# EAGLE design pandemic_proto_v0001 (EAGLE 9.0.0)

## Sheet 1 of 4: PSU
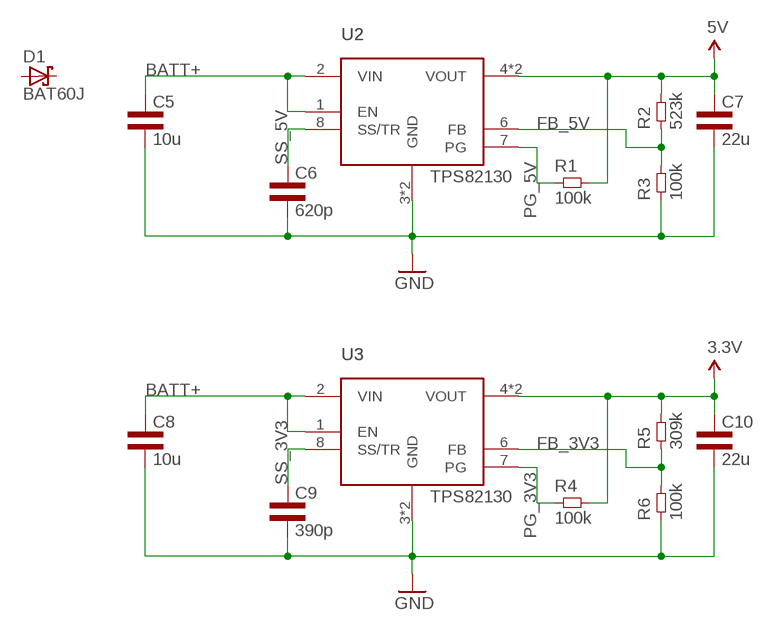
[diagram p0: schematic, sheet 1]

### Parts
C5  10u  CAP1206L3  [1206L3]
C6  620p  CAP0402L3  [0402L3]
C7  22u  CAP0805L3  [0805L3]
C8  10u  CAP1206L3  [1206L3]
C9  390p  CAP0402L3  [0402L3]
C10  22u  CAP0805L3  [0805L3]
D1  BAT60J  [SOD323_ST]
R1  100k  RES0402L3  [0402L3]
R2  523k  RES0402L3  [0402L3]
R3  100k  RES0805L3  [0805L3]
R4  100k  RES0402L3  [0402L3]
R5  309k  RES0402L3  [0402L3]
R6  100k  RES0805L3  [0805L3]
U2  TPS82130  [SIL0008C]
U3  TPS82130  [SIL0008C]

### Nets
3.3V: C10.1 R4.P$2 R5.P$2 U3.4(VOUT) U3.5(VOUT) ; also sheet 3
5V: C7.1 R1.P$2 R2.P$2 U2.4(VOUT) U2.5(VOUT)
BATT+: C5.1 C8.1 U2.1(EN) U2.2(VIN) U3.1(EN) U3.2(VIN) ; also sheet 2
FB_3V3: R5.P$1 R6.2 U3.6(FB)
FB_5V: R2.P$1 R3.2 U2.6(FB)
GND: C5.2 C6.P$2 C7.2 C8.2 C9.P$2 C10.2 R3.1 R6.1 U2.3(GND) U2.TP(GND) U3.3(GND) U3.TP(GND) ; also sheet 2,3
PG_3V3: R4.P$1 U3.7(PG)
PG_5V: R1.P$1 U2.7(PG)
SS_3V3: C9.P$1 U3.8(SS/TR)
SS_5V: C6.P$1 U2.8(SS/TR)
Unconnected: D1.A D1.C

## Sheet 2 of 4: Gate Driver
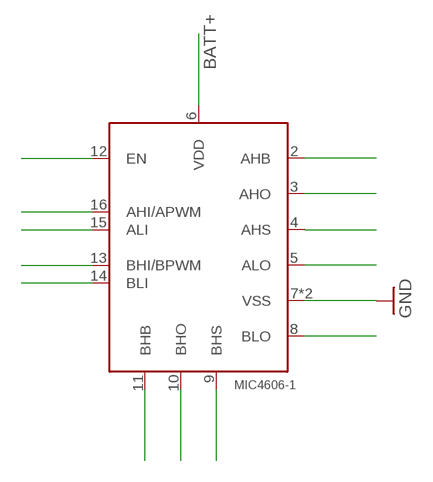
[diagram p1: schematic, sheet 2]

### Parts
MD1  MIC4606-1  [QFN44-16LD-PL-2]

### Nets
BATT+: MD1.6(VDD) ; also sheet 1
GND: MD1.7(VSS) MD1.TP(VSS) ; also sheet 1,3
N$2: MD1.12(EN)
N$10: MD1.16(AHI/APWM)
N$11: MD1.15(ALI)
N$12: MD1.13(BHI/BPWM)
N$13: MD1.14(BLI)
N$14: MD1.2(AHB)
N$15: MD1.3(AHO)
N$16: MD1.4(AHS)
N$17: MD1.5(ALO)
N$18: MD1.8(BLO)
N$19: MD1.9(BHS)
N$20: MD1.10(BHO)
N$21: MD1.11(BHB)

## Sheet 3 of 4: Braaaiiiins!
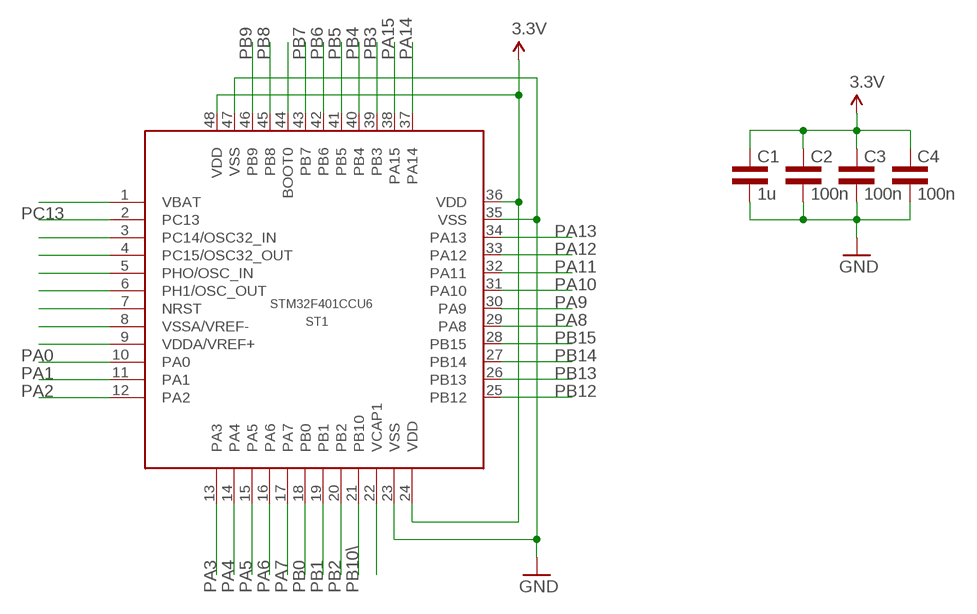
[diagram p2: schematic, sheet 3]

### Parts
C1  1u  CAP0805L3  [0805L3]
C2  100n  CAP0402L3  [0402L3]
C3  100n  CAP0402L3  [0402L3]
C4  100n  CAP0402L3  [0402L3]
ST1  STM32F401CCU6  [UFQFPN48]

### Nets
3.3V: C1.1 C2.P$1 C3.P$1 C4.P$1 ST1.24(VDD) ST1.36(VDD) ST1.48(VDD) ; also sheet 1
GND: C1.2 C2.P$2 C3.P$2 C4.P$2 ST1.23(VSS) ST1.35(VSS) ST1.47(VSS) ; also sheet 1,2
N$1: ST1.1(VBAT)
N$3: ST1.3(PC14/OSC32_IN)
N$4: ST1.4(PC15/OSC32_OUT)
N$5: ST1.5(PHO/OSC_IN)
N$6: ST1.6(PH1/OSC_OUT)
N$7: ST1.7(NRST)
N$8: ST1.8(VSSA/VREF-)
N$9: ST1.9(VDDA/VREF+)
N$29: ST1.44(BOOT0)
N$46: ST1.22(VCAP1)
PA0: ST1.10(PA0)
PA1: ST1.11(PA1)
PA2: ST1.12(PA2)
PA3: ST1.13(PA3)
PA4: ST1.14(PA4)
PA5: ST1.15(PA5)
PA6: ST1.16(PA6)
PA7: ST1.17(PA7)
PA8: ST1.29(PA8)
PA9: ST1.30(PA9)
PA10: ST1.31(PA10)
PA11: ST1.32(PA11)
PA12: ST1.33(PA12)
PA13: ST1.34(PA13)
PA14: ST1.37(PA14)
PA15: ST1.38(PA15)
PB0: ST1.18(PB0)
PB1: ST1.19(PB1)
PB2: ST1.20(PB2)
PB3: ST1.39(PB3)
PB4: ST1.40(PB4)
PB5: ST1.41(PB5)
PB6: ST1.42(PB6)
PB7: ST1.43(PB7)
PB8: ST1.45(PB8)
PB9: ST1.46(PB9)
PB10\: ST1.21(PB10)
PB12: ST1.25(PB12)
PB13: ST1.26(PB13)
PB14: ST1.27(PB14)
PB15: ST1.28(PB15)
PC13: ST1.2(PC13)

## Sheet 4 of 4: Ohmmeter
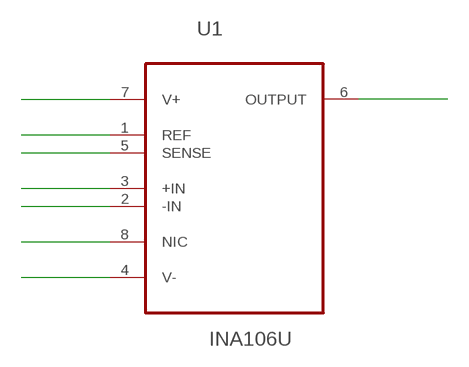
[diagram p3: schematic, sheet 4]

### Parts
U1  INA106U  [SOIC127P600X175-8N]

### Nets
N$22: U1.7(V+)
N$23: U1.1(REF)
N$24: U1.5(SENSE)
N$25: U1.3(+IN)
N$26: U1.2(-IN)
N$27: U1.8(NIC)
N$28: U1.4(V-)
N$30: U1.6(OUTPUT)

## Library data of the parts
C1-C10 = common:CAP
D1 = diode:BAT60J: Schottky barrier diode Source: www.st.com, BAT60J.pdf
MD1 = common:MIC4606: 85V Full-Bridge Mosfet Driver
R1-R6 = common:RES
ST1 = common:STM32F401CCU6
U1 = Texas Instruments_By_element14_Batch_1:INA106U: DIFFERENTIAL AMPLIFIER; MPN: INA106U; OC_FARNELL: 1212395; OC_NEWARK: 74C9754; PACKAGE: SOIC-8; SUPPLIER: TI
U2 U3 = common:TPS82130

## Board
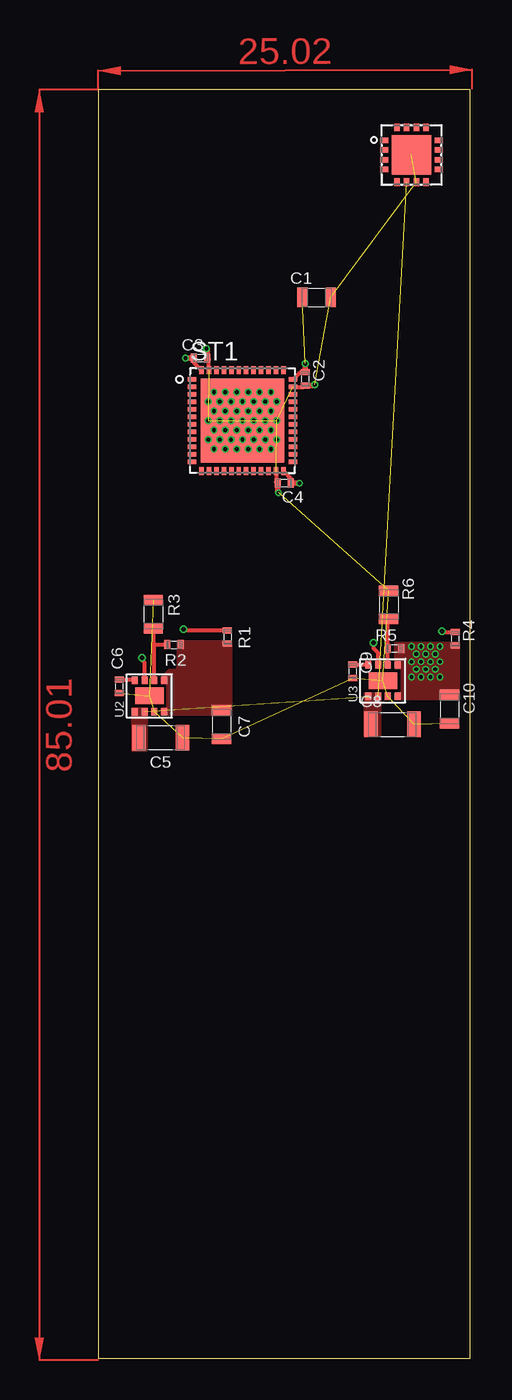
[diagram p4: board, top side]
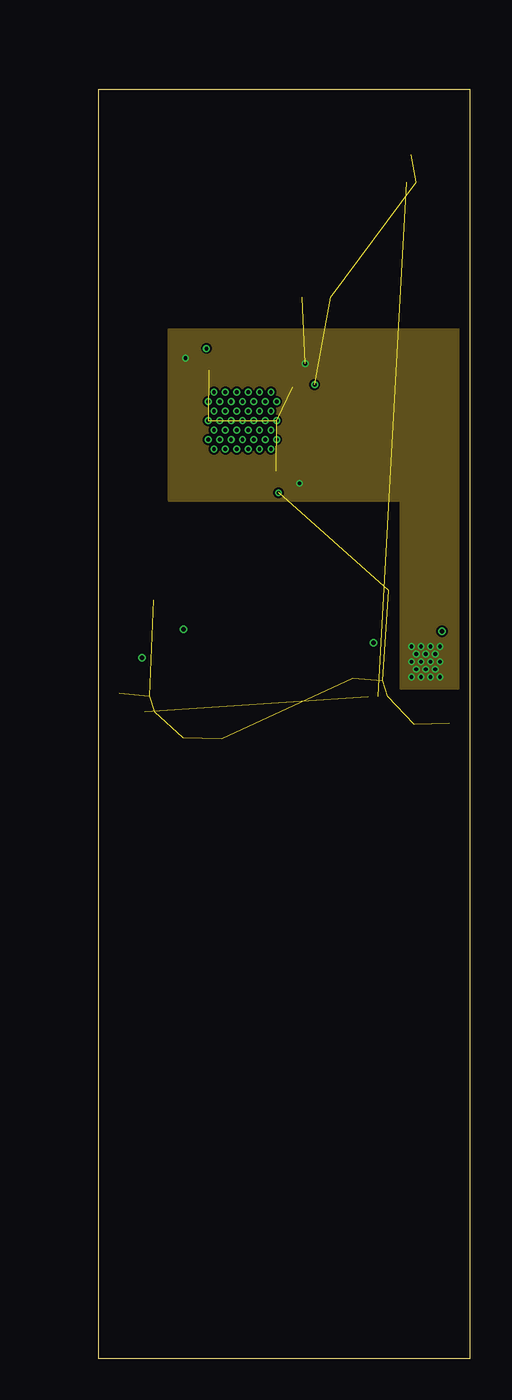
[diagram p5: board, inner layer Route2]
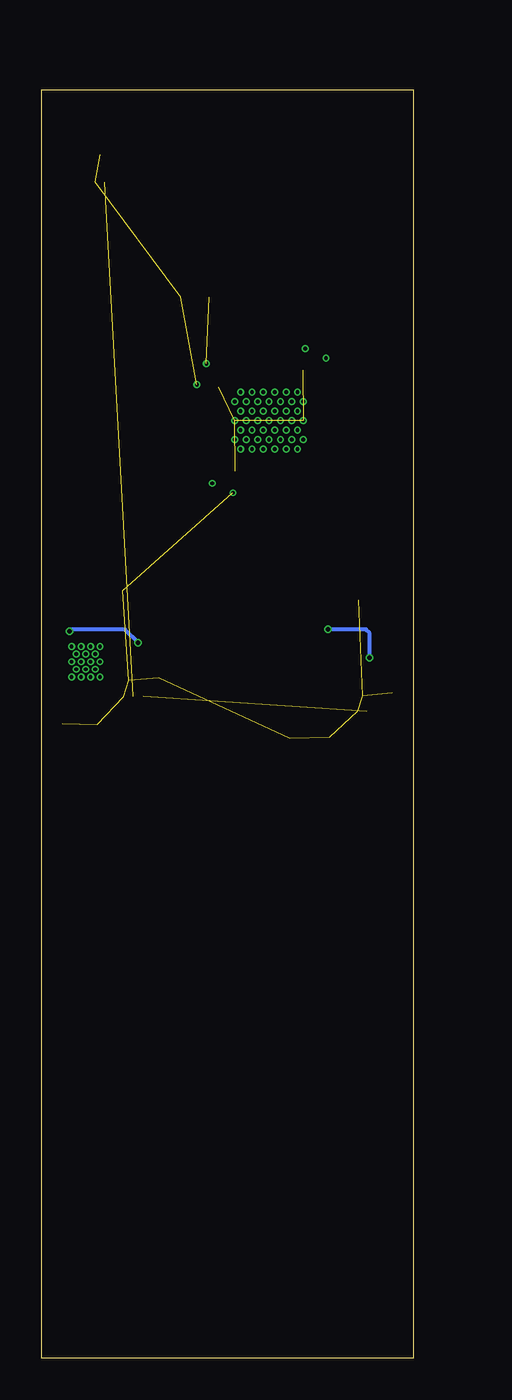
[diagram p6: board, bottom side, seen from below]

Size 24.87 x 84.89 mm. Coordinates in mm from the lower left corner, seen from the top.
Outline: 0,0 24.87,0 24.87,84.89 0,84.89 0,0
Copper layers (1*2*3*16): Top 0.035mm / dielectric 1.5mm / Route2 0.035mm / dielectric 0.15mm / Route3 0.035mm / dielectric 0.2mm / Bottom 0.035mm
Design rules "default *": minimum track width 5mil, minimum drill 10mil, track to track 5mil, track to pad 5mil, pad to pad 5mil, via to via 5mil, smd to smd 5mil, copper to edge 20mil, drill to drill 6mil, minimum pad ring 4mil, minimum via ring 4mil, stop-mask expansion 4mil, vias tented up to drill 0mil, thermal gap 10mil

### Footprints (pad centres in the part's own frame; a part is rotated, then mirrored left to right if it is on the bottom)
0805L3 = smd 0.7 x 1.3: 1 -0.95,0; 2 0.95,0
0402L3 = smd 0.4 x 0.6: P$1 -0.45,0; P$2 0.45,0
1206L3 = smd 0.9 x 1.7: 1 -1.45,0; 2 1.45,0
SOD323_ST = smd 0.8 x 0.6: A 1.25,0; C -1.25,0
QFN44-16LD-PL-2 = smd 0.53 x 0.36: 1 -1.835,0.975; 2 -1.835,0.325; 3 -1.835,-0.325; 4 -1.835,-0.975; 9 1.835,-0.975; 10 1.835,-0.325; 11 1.835,0.325; 12 1.835,0.975 | smd 0.36 x 0.53: 5 -0.975,-1.835; 6 -0.325,-1.835; 7 0.325,-1.835; 8 0.975,-1.835; 13 0.975,1.835; 14 0.325,1.835; 15 -0.325,1.835; 16 -0.975,1.835 | smd 2.65 x 2.65: TP 0,0
UFQFPN48 = smd 0.55 x 0.3: 1 -3.375,2.75; 2 -3.375,2.25; 3 -3.375,1.75; 4 -3.375,1.25; 5 -3.375,0.75; 6 -3.375,0.25; 7 -3.375,-0.25; 8 -3.375,-0.75; 9 -3.375,-1.25; 10 -3.375,-1.75; 11 -3.375,-2.25; 12 -3.375,-2.75; 25 3.375,-2.75; 26 3.375,-2.25; 27 3.375,-1.75; 28 3.375,-1.25; 29 3.375,-0.75; 30 3.375,-0.25; 31 3.375,0.25; 32 3.375,0.75; 33 3.375,1.25; 34 3.375,1.75; 35 3.375,2.25; 36 3.375,2.75 | smd 0.3 x 0.55: 13 -2.75,-3.375; 14 -2.25,-3.375; 15 -1.75,-3.375; 16 -1.25,-3.375; 17 -0.75,-3.375; 18 -0.25,-3.375; 19 0.25,-3.375; 20 0.75,-3.375; 21 1.25,-3.375; 22 1.75,-3.375; 23 2.25,-3.375; 24 2.75,-3.375; 37 2.75,3.375; 38 2.25,3.375; 39 1.75,3.375; 40 1.25,3.375; 41 0.75,3.375; 42 0.25,3.375; 43 -0.25,3.375; 44 -0.75,3.375; 45 -1.25,3.375; 46 -1.75,3.375; 47 -2.25,3.375; 48 -2.75,3.375 | smd 5.6 x 5.6: TP 0,0
SOIC127P600X175-8N = smd 1.981 x 0.559: 1 -2.464,1.905; 2 -2.464,0.635; 3 -2.464,-0.635; 4 -2.464,-1.905; 5 2.464,-1.905; 6 2.464,-0.635; 7 2.464,0.635; 8 2.464,1.905
SIL0008C = smd 0.5 x 0.4: 1 -1.05,0.975; 2 -1.05,0.325; 3 -1.05,-0.325; 4 -1.05,-0.975; 5 1.05,-0.975; 6 1.05,-0.325; 7 1.05,0.325; 8 1.05,0.975 | smd 1.1 x 1.9: TP 0,0

### Placement (x,y rotation side)
C1  14.61,70.99 0 top
C2  13.84,65.53 270 top
C3  6.86,66.93 0 top
C4  12.45,58.55 180 top
C5  4.19,41.53 0 top
C6  1.4,44.96 270 top
C7  8.26,42.42 270 top
C8  19.68,42.42 0 top
C9  17.02,45.97 270 top
C10  23.5,43.43 270 top
D1  -12.7,4.19 0 top  (outside the outline)
MD1  20.95,80.52 0 top
R1  8.64,48.26 270 top
R2  5.08,47.75 0 top
R3  3.68,49.78 270 top
R4  23.88,48.13 270 top
R5  19.81,47.5 0 top
R6  19.43,50.42 270 top
ST1  9.65,62.74 0 top
U1  38.73,5.21 0 top  (outside the outline)
U2  3.43,44.32 90 top
U3  19.05,45.34 90 top

### Tracks (layer width: path | path; a pad name or v marks a point on that pad's centre or on a via)
3.3V  (via drill 0.25 pad 0.46)  (1 unrouted)
  Top 0.254: ST1.48 6.41,66.61 C3.P$1 | ST1.36 13.52,65.98 C2.P$1 | ST1.24 12.9,58.87 C4.P$1
  Top 0.381: C4.P$1 v13.46,58.55 | v13.84,66.55 C2.P$1 | v5.84,66.93 C3.P$1
  other vias: 20.95,47.62 21.59,47.62 22.23,47.62 22.86,47.62 22.54,47.12 21.91,47.12 21.27,47.12 20.95,46.61 21.59,46.61 22.23,46.61 22.86,46.61 22.54,46.1 21.91,46.1 21.27,46.1 20.95,45.59 21.59,45.59 22.23,45.59 22.86,45.59
  pour Top (no thermals): 19.88,44.51 20.26,44.51 20.32,44.58 20.32,46.1 20.26,46.16 19.88,46.16 19.88,47.88 24.13,47.88 24.13,44.07 19.88,44.07
  pour Route2: 24.13,44.83 24.13,68.83 4.7,68.83 4.7,57.4 20.19,57.4 20.19,44.83
5V
  Top 0.127: 8.16,43.27 C7.1
  pour Top (no thermals): 4.25,43.05 4.25,43.5 4.57,43.5 4.64,43.56 4.64,45.09 4.57,45.15 4.25,45.15 4.25,45.59 4.76,46.1 5.21,46.1 5.33,46.23 5.33,48.01 8.89,48.01 8.89,43.05
BATT+  (2 unrouted)
  pour Top (no thermals): 2.29,40.64 2.29,43.5 3.24,43.5 3.24,40.64
  pour Top (no thermals): 17.84,41.59 17.84,44.51 18.86,44.51 18.86,41.59
FB_3V3
  Top 0.254: U3.6 19.38,47.48 R5.P$1 19.36,49.4 R6.2
FB_5V
  Top 0.254: 3.81,47.75 R2.P$1 | U2.6 3.75,47.7 3.81,47.75 | R3.2 3.68,47.88 3.81,47.75
GND  (via drill 0.25 pad 0.46)  (24 unrouted)
  Top 0.254: ST1.35 13.75,64.99 C2.P$2 | ST1.23 11.9,58.64 C4.P$2 | ST1.47 7.4,66.83 C3.P$2
  Top 0.381: v12.06,57.91 12,57.98 C4.P$2 | v14.48,65.15 14.41,65.08 C2.P$2 | v7.24,67.56 7.31,67.5 C3.P$2
  other vias: 9.65,62.74 10.41,62.74 11.18,62.74 11.94,62.74 8.89,62.74 8.13,62.74 7.37,62.74 7.75,63.37 10.03,63.37 8.51,63.37 9.27,63.37 10.79,63.37 11.56,63.37 7.75,62.1 8.51,62.1 9.27,62.1 10.03,62.1 10.79,62.1 11.56,62.1 7.37,64.01 8.13,64.01 8.89,64.01 9.65,64.01 10.41,64.01 11.18,64.01 11.94,64.01 7.75,64.64 8.51,64.64 9.27,64.64 10.03,64.64 10.79,64.64 11.56,64.64 7.37,61.47 8.13,61.47 8.89,61.47 9.65,61.47 10.41,61.47 11.18,61.47 11.94,61.47 7.75,60.83 8.51,60.83 9.27,60.83 10.03,60.83 10.79,60.83 11.56,60.83
PG_3V3  (via drill 0.3)
  Top 0.254: U3.7 18.73,47.19 18.41,47.5 v18.41,47.88 | v22.99,48.64 23.05,48.58 R4.P$1
  Bottom 0.254: v18.41,47.88 19.3,48.77 22.86,48.77 v22.99,48.64
PG_5V  (via drill 0.3)
  Top 0.127: U2.7 3.17,45.44
  Top 0.254: U2.7 3.1,46.54 3.11,46.55 2.92,46.74 v2.92,46.86 | R1.P$1 5.77,48.71 v5.71,48.77
  Bottom 0.254: v2.92,46.86 2.92,48.51 3.17,48.77 v5.71,48.77
SS_3V3
  Top 0.254: U3.8 17.05,46.39 C9.P$1
SS_5V
  Top 0.254: U2.8 1.43,45.37 C6.P$1
(copper drawn outside any net)
  shapes: Route3 area x1, Top area x2